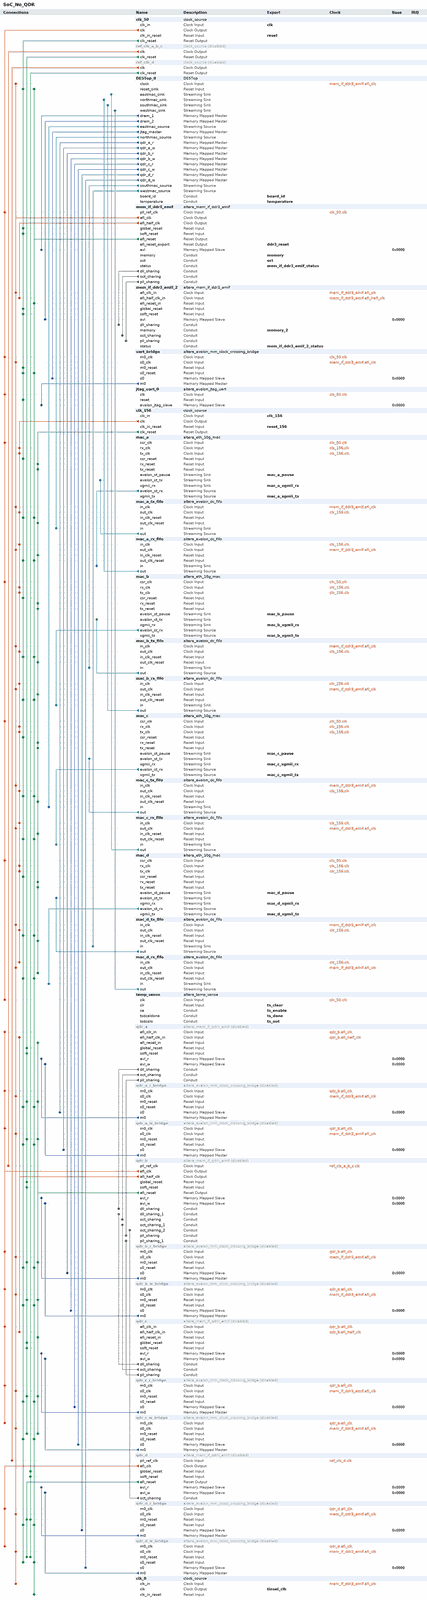
[diagram p0: system contents, whole]
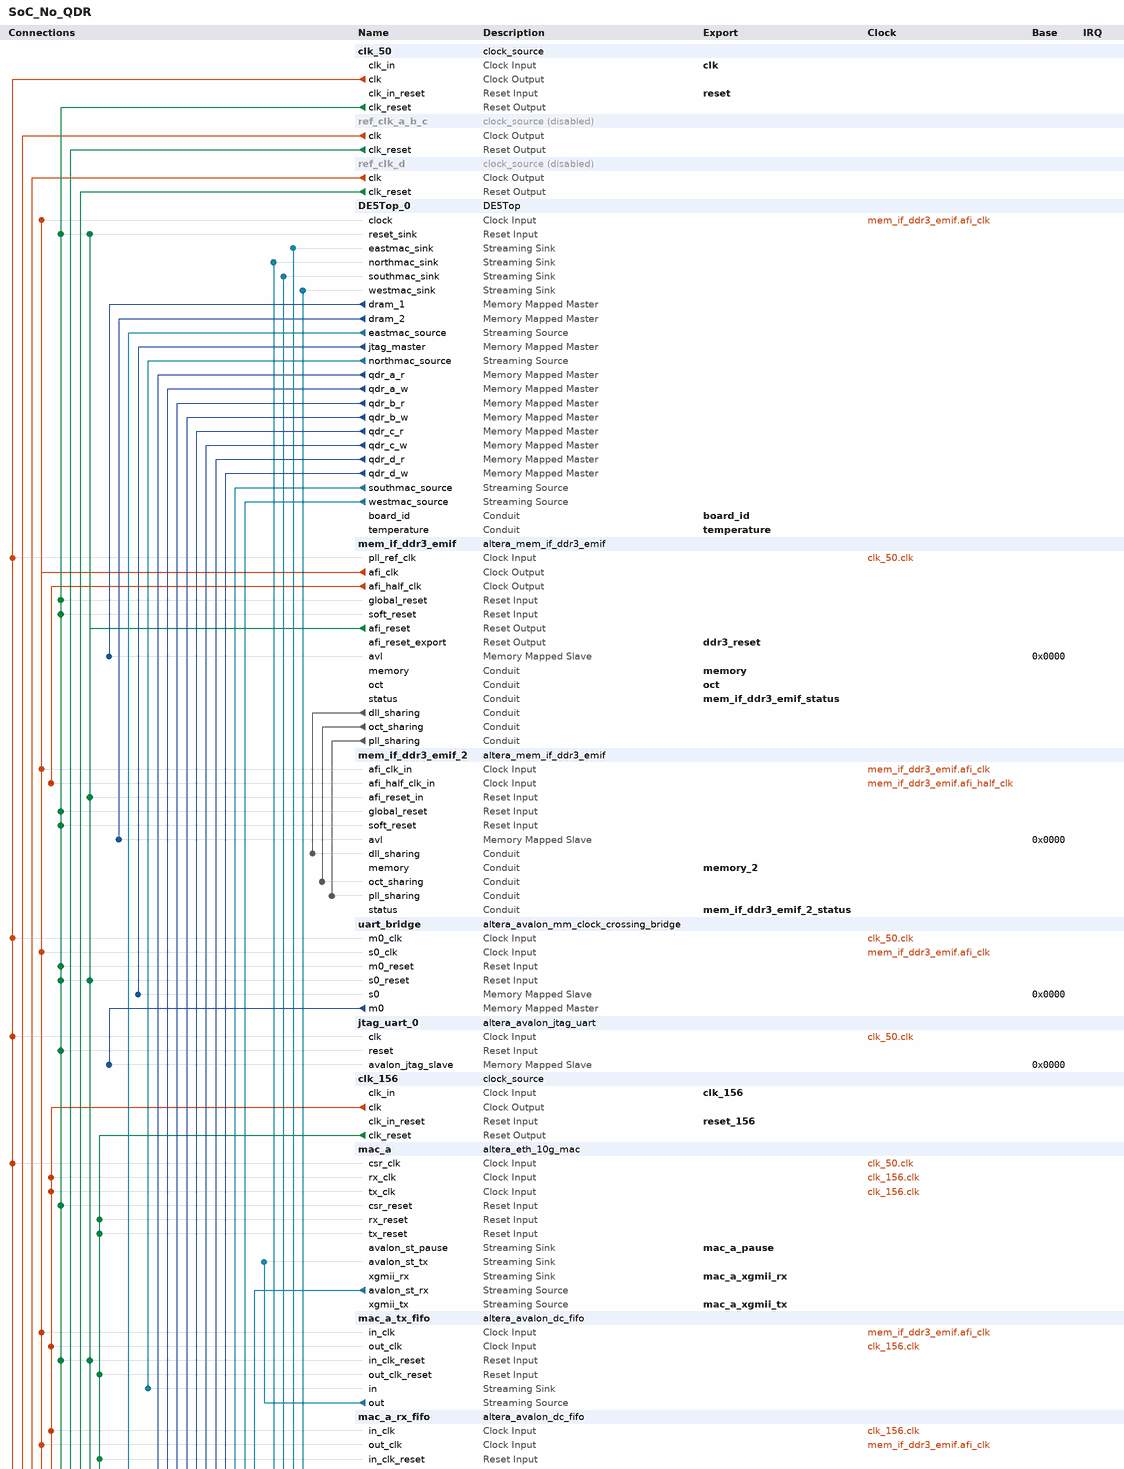
[diagram p1: system contents, upper part]
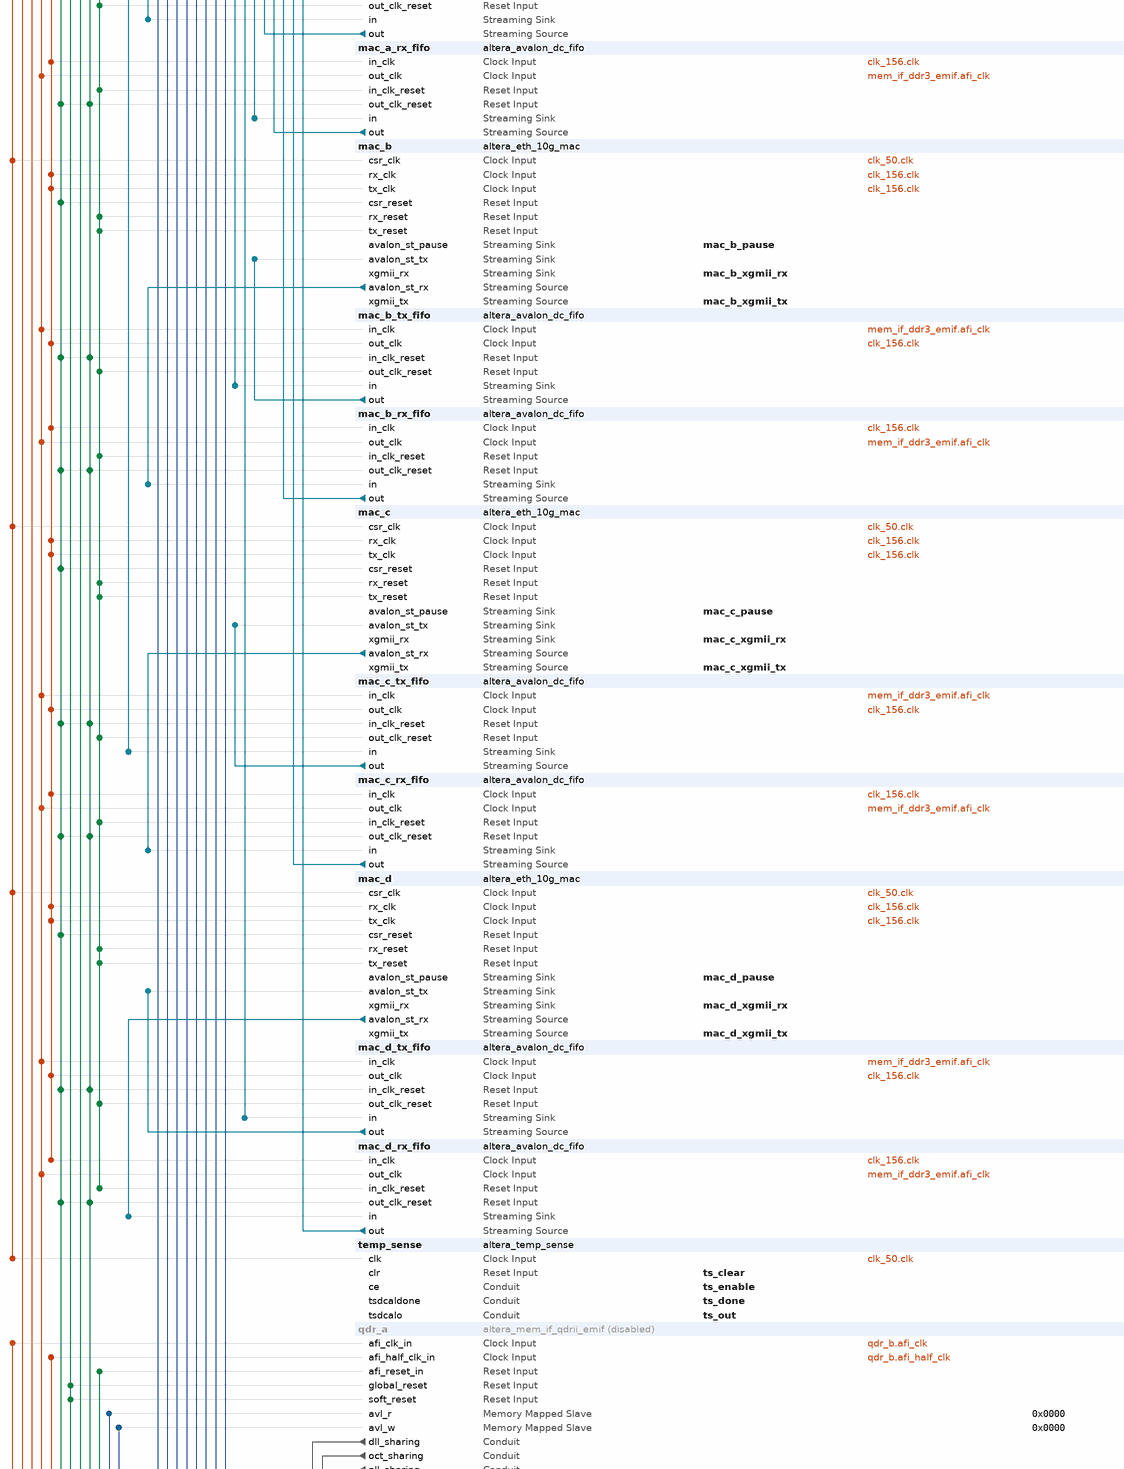
[diagram p2: system contents, middle part]
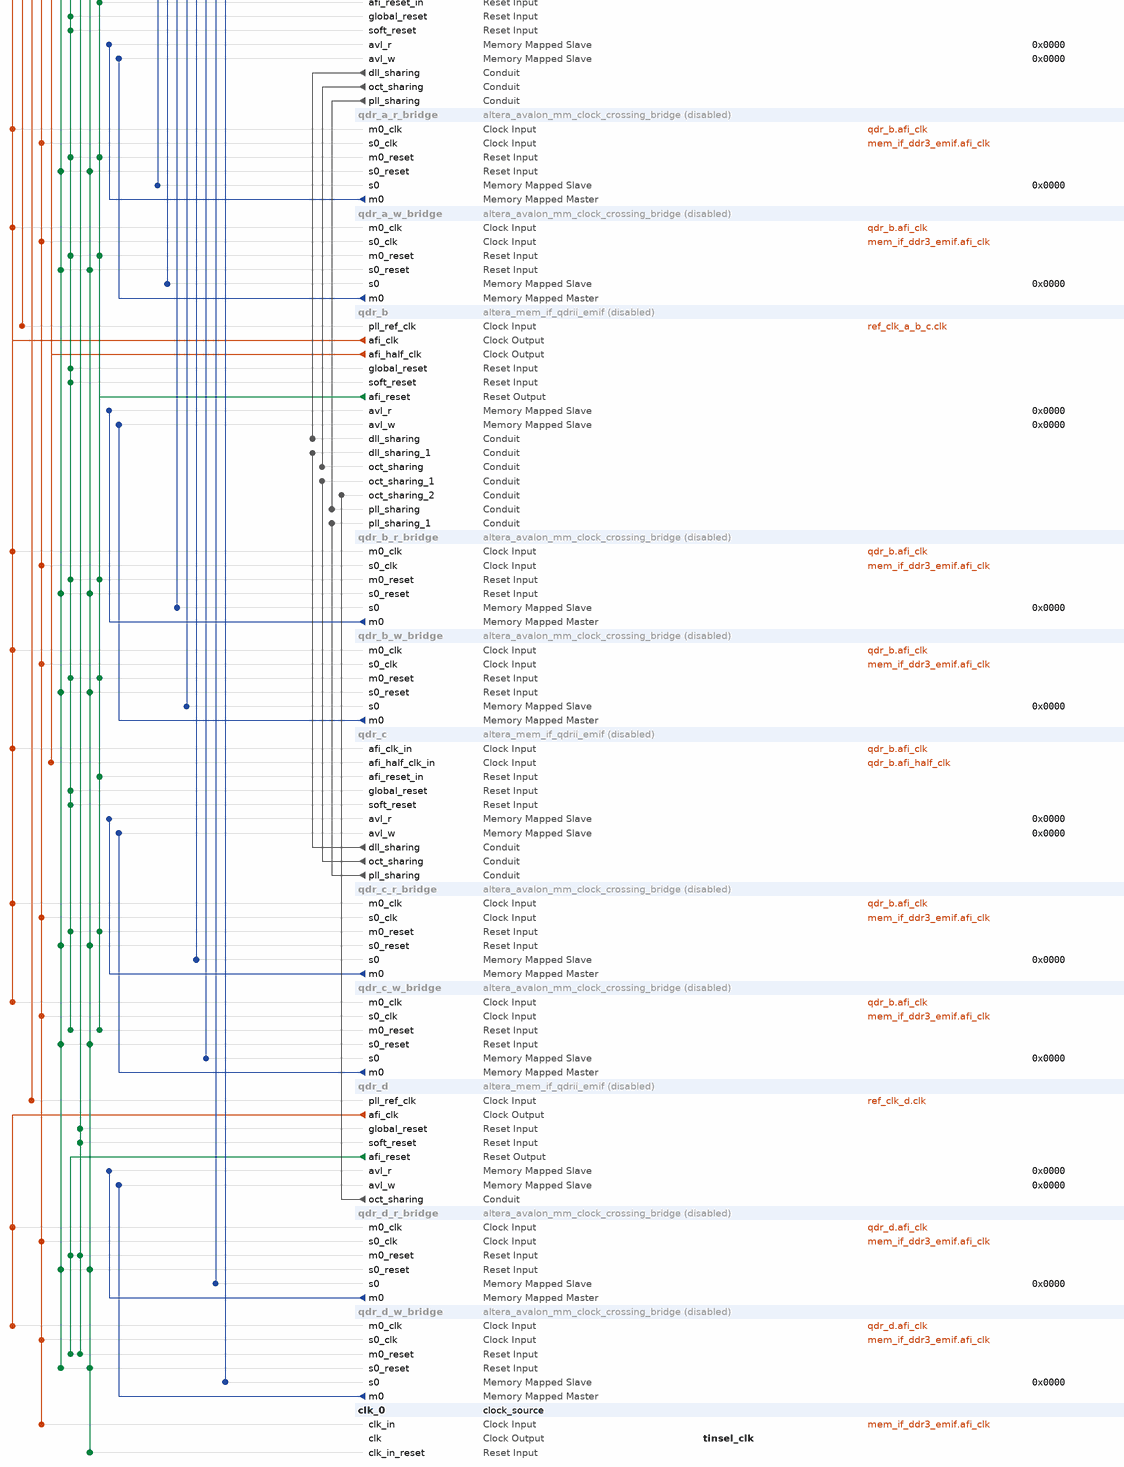
[diagram p3: system contents, lower part]
# Platform Designer (Qsys) system SoC_No_QDR, Stratix V 5SGXEA7N2F45C2
# Parameters at their usual value, and those the tool derives, are not listed.
package require -exact qsys 16.1
create_system SoC_No_QDR
set_project_property DEVICE_FAMILY {Stratix V}
set_project_property DEVICE 5SGXEA7N2F45C2

add_instance clk_50 clock_source 16.1
set_instance_parameter_value clk_50 clockFrequency 50000000

add_instance ref_clk_a_b_c clock_source 16.1
set_instance_property ref_clk_a_b_c ENABLED false
set_instance_parameter_value ref_clk_a_b_c clockFrequency 50000000

add_instance ref_clk_d clock_source 16.1
set_instance_property ref_clk_d ENABLED false
set_instance_parameter_value ref_clk_d clockFrequency 50000000

add_instance DE5Top_0 DE5Top 1.0

add_instance mem_if_ddr3_emif altera_mem_if_ddr3_emif 16.1
set_instance_parameter_value mem_if_ddr3_emif AVL_MAX_SIZE 8
set_instance_parameter_value mem_if_ddr3_emif CALIBRATION_MODE Skip
set_instance_parameter_value mem_if_ddr3_emif CPORT_TYPE_PORT Bidirectional,Bidirectional,Bidirectional,Bidirectional,Bidirectional,Bidirectional
set_instance_parameter_value mem_if_ddr3_emif CTL_LOOK_AHEAD_DEPTH 8
set_instance_parameter_value mem_if_ddr3_emif DLL_SHARING_MODE Master
set_instance_parameter_value mem_if_ddr3_emif EXPORT_AFI_HALF_CLK false
set_instance_parameter_value mem_if_ddr3_emif HARD_EMIF false
set_instance_parameter_value mem_if_ddr3_emif MEM_BANKADDR_WIDTH 3
set_instance_parameter_value mem_if_ddr3_emif MEM_CLK_FREQ 430.0
set_instance_parameter_value mem_if_ddr3_emif MEM_CLK_FREQ_MAX 800.0
set_instance_parameter_value mem_if_ddr3_emif MEM_COL_ADDR_WIDTH 10
set_instance_parameter_value mem_if_ddr3_emif MEM_DQ_WIDTH 64
set_instance_parameter_value mem_if_ddr3_emif MEM_FORMAT UNBUFFERED
set_instance_parameter_value mem_if_ddr3_emif MEM_ROW_ADDR_WIDTH 15
set_instance_parameter_value mem_if_ddr3_emif MEM_TCL 11
set_instance_parameter_value mem_if_ddr3_emif MEM_TFAW_NS 30.0
set_instance_parameter_value mem_if_ddr3_emif MEM_TRAS_NS 35.0
set_instance_parameter_value mem_if_ddr3_emif MEM_TRCD_NS 13.75
set_instance_parameter_value mem_if_ddr3_emif MEM_TRFC_NS 160.0
set_instance_parameter_value mem_if_ddr3_emif MEM_TRP_NS 13.75
set_instance_parameter_value mem_if_ddr3_emif MEM_TRRD_NS 6.0
set_instance_parameter_value mem_if_ddr3_emif MEM_TRTP_NS 7.5
set_instance_parameter_value mem_if_ddr3_emif MEM_TWTR 4
set_instance_parameter_value mem_if_ddr3_emif MEM_VENDOR Micron
set_instance_parameter_value mem_if_ddr3_emif MEM_WTCL 8
set_instance_parameter_value mem_if_ddr3_emif OCT_SHARING_MODE Master
set_instance_parameter_value mem_if_ddr3_emif PLL_LOCATION Left_Right
set_instance_parameter_value mem_if_ddr3_emif PLL_SHARING_MODE Master
set_instance_parameter_value mem_if_ddr3_emif POWER_OF_TWO_BUS true
set_instance_parameter_value mem_if_ddr3_emif PRIORITY_PORT 0,1,1,1,1,1
set_instance_parameter_value mem_if_ddr3_emif RATE Half
set_instance_parameter_value mem_if_ddr3_emif REF_CLK_FREQ 50.0
set_instance_parameter_value mem_if_ddr3_emif SPEED_GRADE 2
set_instance_parameter_value mem_if_ddr3_emif TIMING_BOARD_AC_SKEW 0.05
set_instance_parameter_value mem_if_ddr3_emif TIMING_BOARD_AC_TO_CK_SKEW 0.012
set_instance_parameter_value mem_if_ddr3_emif TIMING_BOARD_DQ_TO_DQS_SKEW 0.002
set_instance_parameter_value mem_if_ddr3_emif TIMING_BOARD_MAX_CK_DELAY 1.78
set_instance_parameter_value mem_if_ddr3_emif TIMING_BOARD_MAX_DQS_DELAY 0.7
set_instance_parameter_value mem_if_ddr3_emif TIMING_BOARD_SKEW_BETWEEN_DQS 0.1
set_instance_parameter_value mem_if_ddr3_emif TIMING_BOARD_SKEW_CKDQS_DIMM_MAX 1.29
set_instance_parameter_value mem_if_ddr3_emif TIMING_BOARD_SKEW_CKDQS_DIMM_MIN 0.06
set_instance_parameter_value mem_if_ddr3_emif TIMING_BOARD_SKEW_WITHIN_DQS 0.009
set_instance_parameter_value mem_if_ddr3_emif TIMING_TDH 45
set_instance_parameter_value mem_if_ddr3_emif TIMING_TDQSCK 255
set_instance_parameter_value mem_if_ddr3_emif TIMING_TDQSQ 100
set_instance_parameter_value mem_if_ddr3_emif TIMING_TDQSS 0.27
set_instance_parameter_value mem_if_ddr3_emif TIMING_TDS 10
set_instance_parameter_value mem_if_ddr3_emif TIMING_TDSH 0.18
set_instance_parameter_value mem_if_ddr3_emif TIMING_TDSS 0.18
set_instance_parameter_value mem_if_ddr3_emif TIMING_TIH 120
set_instance_parameter_value mem_if_ddr3_emif TIMING_TIS 170
set_instance_parameter_value mem_if_ddr3_emif TIMING_TQSH 0.4
set_instance_parameter_value mem_if_ddr3_emif USER_DEBUG_LEVEL 0

add_instance mem_if_ddr3_emif_2 altera_mem_if_ddr3_emif 16.1
set_instance_parameter_value mem_if_ddr3_emif_2 AVL_MAX_SIZE 8
set_instance_parameter_value mem_if_ddr3_emif_2 CALIBRATION_MODE Skip
set_instance_parameter_value mem_if_ddr3_emif_2 CPORT_TYPE_PORT Bidirectional,Bidirectional,Bidirectional,Bidirectional,Bidirectional,Bidirectional
set_instance_parameter_value mem_if_ddr3_emif_2 CTL_LOOK_AHEAD_DEPTH 8
set_instance_parameter_value mem_if_ddr3_emif_2 DLL_SHARING_MODE Slave
set_instance_parameter_value mem_if_ddr3_emif_2 EXPORT_AFI_HALF_CLK false
set_instance_parameter_value mem_if_ddr3_emif_2 HARD_EMIF false
set_instance_parameter_value mem_if_ddr3_emif_2 MEM_BANKADDR_WIDTH 3
set_instance_parameter_value mem_if_ddr3_emif_2 MEM_CLK_FREQ 430.0
set_instance_parameter_value mem_if_ddr3_emif_2 MEM_CLK_FREQ_MAX 800.0
set_instance_parameter_value mem_if_ddr3_emif_2 MEM_COL_ADDR_WIDTH 10
set_instance_parameter_value mem_if_ddr3_emif_2 MEM_DQ_WIDTH 64
set_instance_parameter_value mem_if_ddr3_emif_2 MEM_FORMAT UNBUFFERED
set_instance_parameter_value mem_if_ddr3_emif_2 MEM_ROW_ADDR_WIDTH 15
set_instance_parameter_value mem_if_ddr3_emif_2 MEM_TCL 11
set_instance_parameter_value mem_if_ddr3_emif_2 MEM_TFAW_NS 30.0
set_instance_parameter_value mem_if_ddr3_emif_2 MEM_TRAS_NS 35.0
set_instance_parameter_value mem_if_ddr3_emif_2 MEM_TRCD_NS 13.75
set_instance_parameter_value mem_if_ddr3_emif_2 MEM_TRFC_NS 160.0
set_instance_parameter_value mem_if_ddr3_emif_2 MEM_TRP_NS 13.75
set_instance_parameter_value mem_if_ddr3_emif_2 MEM_TRRD_NS 6.0
set_instance_parameter_value mem_if_ddr3_emif_2 MEM_TRTP_NS 7.5
set_instance_parameter_value mem_if_ddr3_emif_2 MEM_TWTR 4
set_instance_parameter_value mem_if_ddr3_emif_2 MEM_VENDOR Micron
set_instance_parameter_value mem_if_ddr3_emif_2 MEM_WTCL 8
set_instance_parameter_value mem_if_ddr3_emif_2 OCT_SHARING_MODE Slave
set_instance_parameter_value mem_if_ddr3_emif_2 PLL_LOCATION Left_Right
set_instance_parameter_value mem_if_ddr3_emif_2 PLL_SHARING_MODE Slave
set_instance_parameter_value mem_if_ddr3_emif_2 POWER_OF_TWO_BUS true
set_instance_parameter_value mem_if_ddr3_emif_2 PRIORITY_PORT 0,1,1,1,1,1
set_instance_parameter_value mem_if_ddr3_emif_2 RATE Half
set_instance_parameter_value mem_if_ddr3_emif_2 REF_CLK_FREQ 50.0
set_instance_parameter_value mem_if_ddr3_emif_2 SPEED_GRADE 2
set_instance_parameter_value mem_if_ddr3_emif_2 TIMING_BOARD_AC_SKEW 0.05
set_instance_parameter_value mem_if_ddr3_emif_2 TIMING_BOARD_AC_TO_CK_SKEW 0.012
set_instance_parameter_value mem_if_ddr3_emif_2 TIMING_BOARD_DQ_TO_DQS_SKEW 0.002
set_instance_parameter_value mem_if_ddr3_emif_2 TIMING_BOARD_MAX_CK_DELAY 1.78
set_instance_parameter_value mem_if_ddr3_emif_2 TIMING_BOARD_MAX_DQS_DELAY 0.7
set_instance_parameter_value mem_if_ddr3_emif_2 TIMING_BOARD_SKEW_BETWEEN_DQS 0.1
set_instance_parameter_value mem_if_ddr3_emif_2 TIMING_BOARD_SKEW_CKDQS_DIMM_MAX 1.29
set_instance_parameter_value mem_if_ddr3_emif_2 TIMING_BOARD_SKEW_CKDQS_DIMM_MIN 0.06
set_instance_parameter_value mem_if_ddr3_emif_2 TIMING_BOARD_SKEW_WITHIN_DQS 0.009
set_instance_parameter_value mem_if_ddr3_emif_2 TIMING_TDH 45
set_instance_parameter_value mem_if_ddr3_emif_2 TIMING_TDQSCK 255
set_instance_parameter_value mem_if_ddr3_emif_2 TIMING_TDQSQ 100
set_instance_parameter_value mem_if_ddr3_emif_2 TIMING_TDQSS 0.27
set_instance_parameter_value mem_if_ddr3_emif_2 TIMING_TDS 10
set_instance_parameter_value mem_if_ddr3_emif_2 TIMING_TDSH 0.18
set_instance_parameter_value mem_if_ddr3_emif_2 TIMING_TDSS 0.18
set_instance_parameter_value mem_if_ddr3_emif_2 TIMING_TIH 120
set_instance_parameter_value mem_if_ddr3_emif_2 TIMING_TIS 170
set_instance_parameter_value mem_if_ddr3_emif_2 TIMING_TQSH 0.4
set_instance_parameter_value mem_if_ddr3_emif_2 USER_DEBUG_LEVEL 0

add_instance uart_bridge altera_avalon_mm_clock_crossing_bridge 16.1
set_instance_parameter_value uart_bridge ADDRESS_WIDTH 10
set_instance_parameter_value uart_bridge COMMAND_FIFO_DEPTH 4
set_instance_parameter_value uart_bridge DATA_WIDTH 32
set_instance_parameter_value uart_bridge MASTER_SYNC_DEPTH 2
set_instance_parameter_value uart_bridge MAX_BURST_SIZE 1
set_instance_parameter_value uart_bridge RESPONSE_FIFO_DEPTH 4
set_instance_parameter_value uart_bridge SLAVE_SYNC_DEPTH 2
set_instance_parameter_value uart_bridge USE_AUTO_ADDRESS_WIDTH 1

add_instance jtag_uart_0 altera_avalon_jtag_uart 16.1
set_instance_parameter_value jtag_uart_0 simInteractiveOptions NO_INTERACTIVE_WINDOWS

add_instance clk_156 clock_source 16.1
set_instance_parameter_value clk_156 clockFrequency 156250000

add_instance mac_a altera_eth_10g_mac 16.1
set_instance_parameter_value mac_a DATAPATH_OPTION 3
set_instance_parameter_value mac_a ENABLE_1G10G_MAC 0
set_instance_parameter_value mac_a ENABLE_PFC 0
set_instance_parameter_value mac_a ENABLE_PTP_1STEP 0
set_instance_parameter_value mac_a ENABLE_SUPP_ADDR 0
set_instance_parameter_value mac_a ENABLE_TIMESTAMPING 0
set_instance_parameter_value mac_a ENABLE_UNIDIRECTIONAL 0
set_instance_parameter_value mac_a INSTANTIATE_STATISTICS 0
set_instance_parameter_value mac_a INSTANTIATE_TX_CRC 1
set_instance_parameter_value mac_a PFC_PRIORITY_NUM 8
set_instance_parameter_value mac_a PREAMBLE_PASSTHROUGH 0
set_instance_parameter_value mac_a REGISTER_BASED_STATISTICS 0
set_instance_parameter_value mac_a TSTAMP_FP_WIDTH 4

add_instance mac_a_tx_fifo altera_avalon_dc_fifo 16.1
set_instance_parameter_value mac_a_tx_fifo BITS_PER_SYMBOL 8
set_instance_parameter_value mac_a_tx_fifo ERROR_WIDTH 1
set_instance_parameter_value mac_a_tx_fifo FIFO_DEPTH 256
set_instance_parameter_value mac_a_tx_fifo SYMBOLS_PER_BEAT 8
set_instance_parameter_value mac_a_tx_fifo USE_PACKETS 1

add_instance mac_a_rx_fifo altera_avalon_dc_fifo 16.1
set_instance_parameter_value mac_a_rx_fifo BITS_PER_SYMBOL 8
set_instance_parameter_value mac_a_rx_fifo ERROR_WIDTH 6
set_instance_parameter_value mac_a_rx_fifo FIFO_DEPTH 256
set_instance_parameter_value mac_a_rx_fifo SYMBOLS_PER_BEAT 8
set_instance_parameter_value mac_a_rx_fifo USE_PACKETS 1

add_instance mac_b altera_eth_10g_mac 16.1
set_instance_parameter_value mac_b DATAPATH_OPTION 3
set_instance_parameter_value mac_b ENABLE_1G10G_MAC 0
set_instance_parameter_value mac_b ENABLE_PFC 0
set_instance_parameter_value mac_b ENABLE_PTP_1STEP 0
set_instance_parameter_value mac_b ENABLE_SUPP_ADDR 0
set_instance_parameter_value mac_b ENABLE_TIMESTAMPING 0
set_instance_parameter_value mac_b ENABLE_UNIDIRECTIONAL 0
set_instance_parameter_value mac_b INSTANTIATE_STATISTICS 0
set_instance_parameter_value mac_b INSTANTIATE_TX_CRC 1
set_instance_parameter_value mac_b PFC_PRIORITY_NUM 8
set_instance_parameter_value mac_b PREAMBLE_PASSTHROUGH 0
set_instance_parameter_value mac_b REGISTER_BASED_STATISTICS 0
set_instance_parameter_value mac_b TSTAMP_FP_WIDTH 4

add_instance mac_b_tx_fifo altera_avalon_dc_fifo 16.1
set_instance_parameter_value mac_b_tx_fifo BITS_PER_SYMBOL 8
set_instance_parameter_value mac_b_tx_fifo ERROR_WIDTH 1
set_instance_parameter_value mac_b_tx_fifo FIFO_DEPTH 256
set_instance_parameter_value mac_b_tx_fifo SYMBOLS_PER_BEAT 8
set_instance_parameter_value mac_b_tx_fifo USE_PACKETS 1

add_instance mac_b_rx_fifo altera_avalon_dc_fifo 16.1
set_instance_parameter_value mac_b_rx_fifo BITS_PER_SYMBOL 8
set_instance_parameter_value mac_b_rx_fifo ERROR_WIDTH 6
set_instance_parameter_value mac_b_rx_fifo FIFO_DEPTH 256
set_instance_parameter_value mac_b_rx_fifo SYMBOLS_PER_BEAT 8
set_instance_parameter_value mac_b_rx_fifo USE_PACKETS 1

add_instance mac_c altera_eth_10g_mac 16.1
set_instance_parameter_value mac_c DATAPATH_OPTION 3
set_instance_parameter_value mac_c ENABLE_1G10G_MAC 0
set_instance_parameter_value mac_c ENABLE_PFC 0
set_instance_parameter_value mac_c ENABLE_PTP_1STEP 0
set_instance_parameter_value mac_c ENABLE_SUPP_ADDR 0
set_instance_parameter_value mac_c ENABLE_TIMESTAMPING 0
set_instance_parameter_value mac_c ENABLE_UNIDIRECTIONAL 0
set_instance_parameter_value mac_c INSTANTIATE_STATISTICS 0
set_instance_parameter_value mac_c INSTANTIATE_TX_CRC 1
set_instance_parameter_value mac_c PFC_PRIORITY_NUM 8
set_instance_parameter_value mac_c PREAMBLE_PASSTHROUGH 0
set_instance_parameter_value mac_c REGISTER_BASED_STATISTICS 0
set_instance_parameter_value mac_c TSTAMP_FP_WIDTH 4

add_instance mac_c_tx_fifo altera_avalon_dc_fifo 16.1
set_instance_parameter_value mac_c_tx_fifo BITS_PER_SYMBOL 8
set_instance_parameter_value mac_c_tx_fifo ERROR_WIDTH 1
set_instance_parameter_value mac_c_tx_fifo FIFO_DEPTH 256
set_instance_parameter_value mac_c_tx_fifo SYMBOLS_PER_BEAT 8
set_instance_parameter_value mac_c_tx_fifo USE_PACKETS 1

add_instance mac_c_rx_fifo altera_avalon_dc_fifo 16.1
set_instance_parameter_value mac_c_rx_fifo BITS_PER_SYMBOL 8
set_instance_parameter_value mac_c_rx_fifo ERROR_WIDTH 6
set_instance_parameter_value mac_c_rx_fifo FIFO_DEPTH 256
set_instance_parameter_value mac_c_rx_fifo SYMBOLS_PER_BEAT 8
set_instance_parameter_value mac_c_rx_fifo USE_PACKETS 1

add_instance mac_d altera_eth_10g_mac 16.1
set_instance_parameter_value mac_d DATAPATH_OPTION 3
set_instance_parameter_value mac_d ENABLE_1G10G_MAC 0
set_instance_parameter_value mac_d ENABLE_PFC 0
set_instance_parameter_value mac_d ENABLE_PTP_1STEP 0
set_instance_parameter_value mac_d ENABLE_SUPP_ADDR 0
set_instance_parameter_value mac_d ENABLE_TIMESTAMPING 0
set_instance_parameter_value mac_d ENABLE_UNIDIRECTIONAL 0
set_instance_parameter_value mac_d INSTANTIATE_STATISTICS 0
set_instance_parameter_value mac_d INSTANTIATE_TX_CRC 1
set_instance_parameter_value mac_d PFC_PRIORITY_NUM 8
set_instance_parameter_value mac_d PREAMBLE_PASSTHROUGH 0
set_instance_parameter_value mac_d REGISTER_BASED_STATISTICS 0
set_instance_parameter_value mac_d TSTAMP_FP_WIDTH 4

add_instance mac_d_tx_fifo altera_avalon_dc_fifo 16.1
set_instance_parameter_value mac_d_tx_fifo BITS_PER_SYMBOL 8
set_instance_parameter_value mac_d_tx_fifo ERROR_WIDTH 1
set_instance_parameter_value mac_d_tx_fifo FIFO_DEPTH 256
set_instance_parameter_value mac_d_tx_fifo SYMBOLS_PER_BEAT 8
set_instance_parameter_value mac_d_tx_fifo USE_PACKETS 1

add_instance mac_d_rx_fifo altera_avalon_dc_fifo 16.1
set_instance_parameter_value mac_d_rx_fifo BITS_PER_SYMBOL 8
set_instance_parameter_value mac_d_rx_fifo ERROR_WIDTH 6
set_instance_parameter_value mac_d_rx_fifo FIFO_DEPTH 256
set_instance_parameter_value mac_d_rx_fifo SYMBOLS_PER_BEAT 8
set_instance_parameter_value mac_d_rx_fifo USE_PACKETS 1

add_instance temp_sense altera_temp_sense 16.1
set_instance_parameter_value temp_sense CBX_AUTO_BLACKBOX ALL
set_instance_parameter_value temp_sense CE_CHECK true
set_instance_parameter_value temp_sense CLK_FREQUENCY 50.0
set_instance_parameter_value temp_sense CLOCK_DIVIDER_VALUE 80
set_instance_parameter_value temp_sense CLR_CHECK true
set_instance_parameter_value temp_sense NUMBER_OF_SAMPLES 128
set_instance_parameter_value temp_sense POI_CAL_TEMPERATURE 85
set_instance_parameter_value temp_sense SIM_TSDCALO 0
set_instance_parameter_value temp_sense USER_OFFSET_ENABLE off
set_instance_parameter_value temp_sense USE_WYS on

add_instance qdr_a altera_mem_if_qdrii_emif 16.1
set_instance_property qdr_a ENABLED false
set_instance_parameter_value qdr_a ABSTRACT_REAL_COMPARE_TEST false
set_instance_parameter_value qdr_a ACV_PHY_CLK_ADD_FR_PHASE 0.0
set_instance_parameter_value qdr_a AC_PACKAGE_DESKEW true
set_instance_parameter_value qdr_a AC_ROM_USER_ADD_0 0_0000_0000_0000
set_instance_parameter_value qdr_a AC_ROM_USER_ADD_1 0_0000_0000_1000
set_instance_parameter_value qdr_a ADD_EFFICIENCY_MONITOR false
set_instance_parameter_value qdr_a ADD_EXTERNAL_SEQ_DEBUG_NIOS false
set_instance_parameter_value qdr_a ADVERTIZE_SEQUENCER_SW_BUILD_FILES false
set_instance_parameter_value qdr_a AFI_DEBUG_INFO_WIDTH 32
set_instance_parameter_value qdr_a AVL_MAX_SIZE 4
set_instance_parameter_value qdr_a BYTE_ENABLE false
set_instance_parameter_value qdr_a C2P_WRITE_CLOCK_ADD_PHASE 0.0
set_instance_parameter_value qdr_a CALIBRATION_MODE Full
set_instance_parameter_value qdr_a CALIB_REG_WIDTH 8
set_instance_parameter_value qdr_a COMMAND_PHASE 0
set_instance_parameter_value qdr_a CORE_DEBUG_CONNECTION EXPORT
set_instance_parameter_value qdr_a CTL_LATENCY 1
set_instance_parameter_value qdr_a CUT_NEW_FAMILY_TIMING true
set_instance_parameter_value qdr_a DEVICE_DEPTH 1
set_instance_parameter_value qdr_a DEVICE_WIDTH 1
set_instance_parameter_value qdr_a DISABLE_CHILD_MESSAGING false
set_instance_parameter_value qdr_a DLL_SHARING_MODE Slave
set_instance_parameter_value qdr_a DQS_DQSN_MODE COMPLEMENTARY
set_instance_parameter_value qdr_a DQ_INPUT_REG_USE_CLKN true
set_instance_parameter_value qdr_a DUPLICATE_AC false
set_instance_parameter_value qdr_a ED_EXPORT_SEQ_DEBUG false
set_instance_parameter_value qdr_a EMULATED_MODE false
set_instance_parameter_value qdr_a EMULATED_WRITE_GROUPS 2
set_instance_parameter_value qdr_a ENABLE_CTRL_AVALON_INTERFACE true
set_instance_parameter_value qdr_a ENABLE_DELAY_CHAIN_WRITE false
set_instance_parameter_value qdr_a ENABLE_EMIT_BFM_MASTER false
set_instance_parameter_value qdr_a ENABLE_EXPORT_SEQ_DEBUG_BRIDGE false
set_instance_parameter_value qdr_a ENABLE_EXTRA_REPORTING false
set_instance_parameter_value qdr_a ENABLE_ISS_PROBES false
set_instance_parameter_value qdr_a ENABLE_NON_DESTRUCTIVE_CALIB false
set_instance_parameter_value qdr_a ENABLE_NON_DES_CAL false
set_instance_parameter_value qdr_a ENABLE_NON_DES_CAL_TEST false
set_instance_parameter_value qdr_a ENABLE_SEQUENCER_MARGINING_ON_BY_DEFAULT false
set_instance_parameter_value qdr_a EXPORT_AFI_HALF_CLK false
set_instance_parameter_value qdr_a FIX_READ_LATENCY 8
set_instance_parameter_value qdr_a FORCE_DQS_TRACKING AUTO
set_instance_parameter_value qdr_a FORCE_MAX_LATENCY_COUNT_WIDTH 0
set_instance_parameter_value qdr_a FORCE_SEQUENCER_TCL_DEBUG_MODE false
set_instance_parameter_value qdr_a FORCE_SHADOW_REGS AUTO
set_instance_parameter_value qdr_a HARD_EMIF false
set_instance_parameter_value qdr_a HCX_COMPAT_MODE false
set_instance_parameter_value qdr_a HHP_HPS false
set_instance_parameter_value qdr_a HHP_HPS_SIMULATION false
set_instance_parameter_value qdr_a HHP_HPS_VERIFICATION false
set_instance_parameter_value qdr_a HPS_PROTOCOL DEFAULT
set_instance_parameter_value qdr_a INCLUDE_BOARD_DELAY_MODEL false
set_instance_parameter_value qdr_a INCLUDE_MULTIRANK_BOARD_DELAY_MODEL false
set_instance_parameter_value qdr_a IO_STANDARD {1.8-V HSTL}
set_instance_parameter_value qdr_a IS_ES_DEVICE false
set_instance_parameter_value qdr_a MARGIN_VARIATION_TEST false
set_instance_parameter_value qdr_a MAX10_RTL_SEQ false
set_instance_parameter_value qdr_a MEM_ADDR_WIDTH 20
set_instance_parameter_value qdr_a MEM_BURST_LENGTH 4
set_instance_parameter_value qdr_a MEM_CK_PHASE 0.0
set_instance_parameter_value qdr_a MEM_CLK_FREQ 450.0
set_instance_parameter_value qdr_a MEM_CONTROL_WIDTH 1
set_instance_parameter_value qdr_a MEM_CS_WIDTH 1
set_instance_parameter_value qdr_a MEM_DENALI_SOMA_FILE qdrii.soma
set_instance_parameter_value qdr_a MEM_DEVICE MISSING_MODEL
set_instance_parameter_value qdr_a MEM_DM_WIDTH 2
set_instance_parameter_value qdr_a MEM_DQ_WIDTH 18
set_instance_parameter_value qdr_a MEM_IF_BOARD_BASE_DELAY 10
set_instance_parameter_value qdr_a MEM_IF_DM_PINS_EN true
set_instance_parameter_value qdr_a MEM_IF_DQSN_EN true
set_instance_parameter_value qdr_a MEM_LEVELING false
set_instance_parameter_value qdr_a MEM_READ_DQS_WIDTH 1
set_instance_parameter_value qdr_a MEM_SUPPRESS_CMD_TIMING_ERROR 0
set_instance_parameter_value qdr_a MEM_T_RL 2.5
set_instance_parameter_value qdr_a MEM_T_WL 1
set_instance_parameter_value qdr_a MEM_USE_DENALI_MODEL false
set_instance_parameter_value qdr_a MEM_VERBOSE true
set_instance_parameter_value qdr_a MEM_WRITE_DQS_WIDTH 1
set_instance_parameter_value qdr_a MRS_MIRROR_PING_PONG_ATSO false
set_instance_parameter_value qdr_a NIOS_ROM_DATA_WIDTH 32
set_instance_parameter_value qdr_a NUM_DLL_SHARING_INTERFACES 1
set_instance_parameter_value qdr_a NUM_EXTRA_REPORT_PATH 10
set_instance_parameter_value qdr_a NUM_OCT_SHARING_INTERFACES 1
set_instance_parameter_value qdr_a NUM_PLL_SHARING_INTERFACES 1
set_instance_parameter_value qdr_a OCT_SHARING_MODE Slave
set_instance_parameter_value qdr_a P2C_READ_CLOCK_ADD_PHASE 0.0
set_instance_parameter_value qdr_a PACKAGE_DESKEW true
set_instance_parameter_value qdr_a PARSE_FRIENDLY_DEVICE_FAMILY_PARAM_VALID false
set_instance_parameter_value qdr_a PHY_CSR_ENABLED false
set_instance_parameter_value qdr_a PHY_ONLY false
set_instance_parameter_value qdr_a PINGPONGPHY_EN false
set_instance_parameter_value qdr_a PLL_ADDR_CMD_CLK_DIV_PARAM 0
set_instance_parameter_value qdr_a PLL_ADDR_CMD_CLK_FREQ_PARAM 0.0
set_instance_parameter_value qdr_a PLL_ADDR_CMD_CLK_MULT_PARAM 0
set_instance_parameter_value qdr_a PLL_ADDR_CMD_CLK_PHASE_PS_PARAM 0
set_instance_parameter_value qdr_a PLL_AFI_CLK_DIV_PARAM 0
set_instance_parameter_value qdr_a PLL_AFI_CLK_FREQ_PARAM 0.0
set_instance_parameter_value qdr_a PLL_AFI_CLK_MULT_PARAM 0
set_instance_parameter_value qdr_a PLL_AFI_CLK_PHASE_PS_PARAM 0
set_instance_parameter_value qdr_a PLL_AFI_HALF_CLK_DIV_PARAM 0
set_instance_parameter_value qdr_a PLL_AFI_HALF_CLK_FREQ_PARAM 0.0
set_instance_parameter_value qdr_a PLL_AFI_HALF_CLK_MULT_PARAM 0
set_instance_parameter_value qdr_a PLL_AFI_HALF_CLK_PHASE_PS_PARAM 0
set_instance_parameter_value qdr_a PLL_AFI_PHY_CLK_DIV_PARAM 0
set_instance_parameter_value qdr_a PLL_AFI_PHY_CLK_FREQ_PARAM 0.0
set_instance_parameter_value qdr_a PLL_AFI_PHY_CLK_MULT_PARAM 0
set_instance_parameter_value qdr_a PLL_AFI_PHY_CLK_PHASE_PS_PARAM 0
set_instance_parameter_value qdr_a PLL_C2P_WRITE_CLK_DIV_PARAM 0
set_instance_parameter_value qdr_a PLL_C2P_WRITE_CLK_FREQ_PARAM 0.0
set_instance_parameter_value qdr_a PLL_C2P_WRITE_CLK_MULT_PARAM 0
set_instance_parameter_value qdr_a PLL_C2P_WRITE_CLK_PHASE_PS_PARAM 0
set_instance_parameter_value qdr_a PLL_CLK_PARAM_VALID false
set_instance_parameter_value qdr_a PLL_CONFIG_CLK_DIV_PARAM 0
set_instance_parameter_value qdr_a PLL_CONFIG_CLK_FREQ_PARAM 0.0
set_instance_parameter_value qdr_a PLL_CONFIG_CLK_MULT_PARAM 0
set_instance_parameter_value qdr_a PLL_CONFIG_CLK_PHASE_PS_PARAM 0
set_instance_parameter_value qdr_a PLL_DR_CLK_DIV_PARAM 0
set_instance_parameter_value qdr_a PLL_DR_CLK_FREQ_PARAM 0.0
set_instance_parameter_value qdr_a PLL_DR_CLK_MULT_PARAM 0
set_instance_parameter_value qdr_a PLL_DR_CLK_PHASE_PS_PARAM 0
set_instance_parameter_value qdr_a PLL_HR_CLK_DIV_PARAM 0
set_instance_parameter_value qdr_a PLL_HR_CLK_FREQ_PARAM 0.0
set_instance_parameter_value qdr_a PLL_HR_CLK_MULT_PARAM 0
set_instance_parameter_value qdr_a PLL_HR_CLK_PHASE_PS_PARAM 0
set_instance_parameter_value qdr_a PLL_LOCATION Top_Bottom
set_instance_parameter_value qdr_a PLL_MEM_CLK_DIV_PARAM 0
set_instance_parameter_value qdr_a PLL_MEM_CLK_FREQ_PARAM 0.0
set_instance_parameter_value qdr_a PLL_MEM_CLK_MULT_PARAM 0
set_instance_parameter_value qdr_a PLL_MEM_CLK_PHASE_PS_PARAM 0
set_instance_parameter_value qdr_a PLL_NIOS_CLK_DIV_PARAM 0
set_instance_parameter_value qdr_a PLL_NIOS_CLK_FREQ_PARAM 0.0
set_instance_parameter_value qdr_a PLL_NIOS_CLK_MULT_PARAM 0
set_instance_parameter_value qdr_a PLL_NIOS_CLK_PHASE_PS_PARAM 0
set_instance_parameter_value qdr_a PLL_P2C_READ_CLK_DIV_PARAM 0
set_instance_parameter_value qdr_a PLL_P2C_READ_CLK_FREQ_PARAM 0.0
set_instance_parameter_value qdr_a PLL_P2C_READ_CLK_MULT_PARAM 0
set_instance_parameter_value qdr_a PLL_P2C_READ_CLK_PHASE_PS_PARAM 0
set_instance_parameter_value qdr_a PLL_SHARING_MODE Slave
set_instance_parameter_value qdr_a PLL_WRITE_CLK_DIV_PARAM 0
set_instance_parameter_value qdr_a PLL_WRITE_CLK_FREQ_PARAM 0.0
set_instance_parameter_value qdr_a PLL_WRITE_CLK_MULT_PARAM 0
set_instance_parameter_value qdr_a PLL_WRITE_CLK_PHASE_PS_PARAM 0
set_instance_parameter_value qdr_a POWER_OF_TWO_BUS true
set_instance_parameter_value qdr_a QDRII_PLUS_MODE false
set_instance_parameter_value qdr_a RATE Half
set_instance_parameter_value qdr_a READ_DQ_DQS_CLOCK_SOURCE DQS_BUS
set_instance_parameter_value qdr_a READ_FIFO_SIZE 8
set_instance_parameter_value qdr_a REFRESH_INTERVAL 15000
set_instance_parameter_value qdr_a REF_CLK_FREQ 50.0
set_instance_parameter_value qdr_a REF_CLK_FREQ_MAX_PARAM 0.0
set_instance_parameter_value qdr_a REF_CLK_FREQ_MIN_PARAM 0.0
set_instance_parameter_value qdr_a REF_CLK_FREQ_PARAM_VALID false
set_instance_parameter_value qdr_a SEQUENCER_TYPE NIOS
set_instance_parameter_value qdr_a SKIP_MEM_INIT true
set_instance_parameter_value qdr_a SOPC_COMPAT_RESET false
set_instance_parameter_value qdr_a SPEED_GRADE 2
set_instance_parameter_value qdr_a TIMING_ADDR_CTRL_SKEW 36
set_instance_parameter_value qdr_a TIMING_BOARD_AC_EYE_REDUCTION_H 0
set_instance_parameter_value qdr_a TIMING_BOARD_AC_EYE_REDUCTION_SU 0
set_instance_parameter_value qdr_a TIMING_BOARD_AC_TO_CK_SKEW 8
set_instance_parameter_value qdr_a TIMING_BOARD_DATA_TO_CQ_SKEW 8
set_instance_parameter_value qdr_a TIMING_BOARD_DATA_TO_K_SKEW 10
set_instance_parameter_value qdr_a TIMING_BOARD_DELTA_DQS_ARRIVAL_TIME 0
set_instance_parameter_value qdr_a TIMING_BOARD_DELTA_READ_DQS_ARRIVAL_TIME 0.0
set_instance_parameter_value qdr_a TIMING_BOARD_DQ_EYE_REDUCTION 0
set_instance_parameter_value qdr_a TIMING_BOARD_READ_DQ_EYE_REDUCTION 0.0
set_instance_parameter_value qdr_a TIMING_BOARD_SKEW 20
set_instance_parameter_value qdr_a TIMING_BOARD_SKEW_BETWEEN_DIMMS 0
set_instance_parameter_value qdr_a TIMING_BOARD_SKEW_BETWEEN_DQS 16
set_instance_parameter_value qdr_a TIMING_BOARD_SKEW_WITHIN_CQ 16
set_instance_parameter_value qdr_a TIMING_BOARD_SKEW_WITHIN_K 23
set_instance_parameter_value qdr_a TIMING_QDR_INTERNAL_JITTER 150
set_instance_parameter_value qdr_a TIMING_TCQD 200
set_instance_parameter_value qdr_a TIMING_TCQDOH -200
set_instance_parameter_value qdr_a TIMING_TCQHCQnH 895
set_instance_parameter_value qdr_a TIMING_THA 300
set_instance_parameter_value qdr_a TIMING_THD 250
set_instance_parameter_value qdr_a TIMING_TKH 400
set_instance_parameter_value qdr_a TIMING_TKHKnH 990
set_instance_parameter_value qdr_a TIMING_TSA 300
set_instance_parameter_value qdr_a TIMING_TSD 250
set_instance_parameter_value qdr_a TRACKING_ERROR_TEST false
set_instance_parameter_value qdr_a TRACKING_WATCH_TEST false
set_instance_parameter_value qdr_a TREFI 35100
set_instance_parameter_value qdr_a TRFC 350
set_instance_parameter_value qdr_a USER_DEBUG_LEVEL 0
set_instance_parameter_value qdr_a USE_FAKE_PHY false
set_instance_parameter_value qdr_a USE_MEM_CLK_FREQ false
set_instance_parameter_value qdr_a USE_SEQUENCER_BFM false

add_instance qdr_a_r_bridge altera_avalon_mm_clock_crossing_bridge 16.1
set_instance_property qdr_a_r_bridge ENABLED false
set_instance_parameter_value qdr_a_r_bridge ADDRESS_UNITS WORDS
set_instance_parameter_value qdr_a_r_bridge ADDRESS_WIDTH 20
set_instance_parameter_value qdr_a_r_bridge COMMAND_FIFO_DEPTH 16
set_instance_parameter_value qdr_a_r_bridge DATA_WIDTH 64
set_instance_parameter_value qdr_a_r_bridge MASTER_SYNC_DEPTH 2
set_instance_parameter_value qdr_a_r_bridge MAX_BURST_SIZE 4
set_instance_parameter_value qdr_a_r_bridge RESPONSE_FIFO_DEPTH 32
set_instance_parameter_value qdr_a_r_bridge SLAVE_SYNC_DEPTH 2
set_instance_parameter_value qdr_a_r_bridge USE_AUTO_ADDRESS_WIDTH 0

add_instance qdr_a_w_bridge altera_avalon_mm_clock_crossing_bridge 16.1
set_instance_property qdr_a_w_bridge ENABLED false
set_instance_parameter_value qdr_a_w_bridge ADDRESS_UNITS WORDS
set_instance_parameter_value qdr_a_w_bridge ADDRESS_WIDTH 20
set_instance_parameter_value qdr_a_w_bridge COMMAND_FIFO_DEPTH 16
set_instance_parameter_value qdr_a_w_bridge DATA_WIDTH 64
set_instance_parameter_value qdr_a_w_bridge MASTER_SYNC_DEPTH 2
set_instance_parameter_value qdr_a_w_bridge MAX_BURST_SIZE 4
set_instance_parameter_value qdr_a_w_bridge RESPONSE_FIFO_DEPTH 32
set_instance_parameter_value qdr_a_w_bridge SLAVE_SYNC_DEPTH 2
set_instance_parameter_value qdr_a_w_bridge USE_AUTO_ADDRESS_WIDTH 0

add_instance qdr_b altera_mem_if_qdrii_emif 16.1
set_instance_property qdr_b ENABLED false
set_instance_parameter_value qdr_b ABSTRACT_REAL_COMPARE_TEST false
set_instance_parameter_value qdr_b ACV_PHY_CLK_ADD_FR_PHASE 0.0
set_instance_parameter_value qdr_b AC_PACKAGE_DESKEW true
set_instance_parameter_value qdr_b AC_ROM_USER_ADD_0 0_0000_0000_0000
set_instance_parameter_value qdr_b AC_ROM_USER_ADD_1 0_0000_0000_1000
set_instance_parameter_value qdr_b ADD_EFFICIENCY_MONITOR false
set_instance_parameter_value qdr_b ADD_EXTERNAL_SEQ_DEBUG_NIOS false
set_instance_parameter_value qdr_b ADVERTIZE_SEQUENCER_SW_BUILD_FILES false
set_instance_parameter_value qdr_b AFI_DEBUG_INFO_WIDTH 32
set_instance_parameter_value qdr_b AVL_MAX_SIZE 4
set_instance_parameter_value qdr_b BYTE_ENABLE false
set_instance_parameter_value qdr_b C2P_WRITE_CLOCK_ADD_PHASE 0.0
set_instance_parameter_value qdr_b CALIBRATION_MODE Full
set_instance_parameter_value qdr_b CALIB_REG_WIDTH 8
set_instance_parameter_value qdr_b COMMAND_PHASE 0
set_instance_parameter_value qdr_b CORE_DEBUG_CONNECTION EXPORT
set_instance_parameter_value qdr_b CTL_LATENCY 1
set_instance_parameter_value qdr_b CUT_NEW_FAMILY_TIMING true
set_instance_parameter_value qdr_b DEVICE_DEPTH 1
set_instance_parameter_value qdr_b DEVICE_WIDTH 1
set_instance_parameter_value qdr_b DISABLE_CHILD_MESSAGING false
set_instance_parameter_value qdr_b DLL_SHARING_MODE Master
set_instance_parameter_value qdr_b DQS_DQSN_MODE COMPLEMENTARY
set_instance_parameter_value qdr_b DQ_INPUT_REG_USE_CLKN true
set_instance_parameter_value qdr_b DUPLICATE_AC false
set_instance_parameter_value qdr_b ED_EXPORT_SEQ_DEBUG false
set_instance_parameter_value qdr_b EMULATED_MODE false
set_instance_parameter_value qdr_b EMULATED_WRITE_GROUPS 2
set_instance_parameter_value qdr_b ENABLE_CTRL_AVALON_INTERFACE true
set_instance_parameter_value qdr_b ENABLE_DELAY_CHAIN_WRITE false
set_instance_parameter_value qdr_b ENABLE_EMIT_BFM_MASTER false
set_instance_parameter_value qdr_b ENABLE_EXPORT_SEQ_DEBUG_BRIDGE false
set_instance_parameter_value qdr_b ENABLE_EXTRA_REPORTING false
set_instance_parameter_value qdr_b ENABLE_ISS_PROBES false
set_instance_parameter_value qdr_b ENABLE_NON_DESTRUCTIVE_CALIB false
set_instance_parameter_value qdr_b ENABLE_NON_DES_CAL false
set_instance_parameter_value qdr_b ENABLE_NON_DES_CAL_TEST false
set_instance_parameter_value qdr_b ENABLE_SEQUENCER_MARGINING_ON_BY_DEFAULT false
set_instance_parameter_value qdr_b EXPORT_AFI_HALF_CLK false
set_instance_parameter_value qdr_b FIX_READ_LATENCY 8
set_instance_parameter_value qdr_b FORCE_DQS_TRACKING AUTO
set_instance_parameter_value qdr_b FORCE_MAX_LATENCY_COUNT_WIDTH 0
set_instance_parameter_value qdr_b FORCE_SEQUENCER_TCL_DEBUG_MODE false
set_instance_parameter_value qdr_b FORCE_SHADOW_REGS AUTO
set_instance_parameter_value qdr_b HARD_EMIF false
set_instance_parameter_value qdr_b HCX_COMPAT_MODE false
set_instance_parameter_value qdr_b HHP_HPS false
set_instance_parameter_value qdr_b HHP_HPS_SIMULATION false
set_instance_parameter_value qdr_b HHP_HPS_VERIFICATION false
set_instance_parameter_value qdr_b HPS_PROTOCOL DEFAULT
set_instance_parameter_value qdr_b INCLUDE_BOARD_DELAY_MODEL false
set_instance_parameter_value qdr_b INCLUDE_MULTIRANK_BOARD_DELAY_MODEL false
set_instance_parameter_value qdr_b IO_STANDARD {1.8-V HSTL}
set_instance_parameter_value qdr_b IS_ES_DEVICE false
set_instance_parameter_value qdr_b MARGIN_VARIATION_TEST false
set_instance_parameter_value qdr_b MAX10_RTL_SEQ false
set_instance_parameter_value qdr_b MEM_ADDR_WIDTH 20
set_instance_parameter_value qdr_b MEM_BURST_LENGTH 4
set_instance_parameter_value qdr_b MEM_CK_PHASE 0.0
set_instance_parameter_value qdr_b MEM_CLK_FREQ 450.0
set_instance_parameter_value qdr_b MEM_CONTROL_WIDTH 1
set_instance_parameter_value qdr_b MEM_CS_WIDTH 1
set_instance_parameter_value qdr_b MEM_DENALI_SOMA_FILE qdrii.soma
set_instance_parameter_value qdr_b MEM_DEVICE MISSING_MODEL
set_instance_parameter_value qdr_b MEM_DM_WIDTH 2
set_instance_parameter_value qdr_b MEM_DQ_WIDTH 18
set_instance_parameter_value qdr_b MEM_IF_BOARD_BASE_DELAY 10
set_instance_parameter_value qdr_b MEM_IF_DM_PINS_EN true
set_instance_parameter_value qdr_b MEM_IF_DQSN_EN true
set_instance_parameter_value qdr_b MEM_LEVELING false
set_instance_parameter_value qdr_b MEM_READ_DQS_WIDTH 1
set_instance_parameter_value qdr_b MEM_SUPPRESS_CMD_TIMING_ERROR 0
set_instance_parameter_value qdr_b MEM_T_RL 2.5
set_instance_parameter_value qdr_b MEM_T_WL 1
set_instance_parameter_value qdr_b MEM_USE_DENALI_MODEL false
set_instance_parameter_value qdr_b MEM_VERBOSE true
set_instance_parameter_value qdr_b MEM_WRITE_DQS_WIDTH 1
set_instance_parameter_value qdr_b MRS_MIRROR_PING_PONG_ATSO false
set_instance_parameter_value qdr_b NIOS_ROM_DATA_WIDTH 32
set_instance_parameter_value qdr_b NUM_DLL_SHARING_INTERFACES 2
set_instance_parameter_value qdr_b NUM_EXTRA_REPORT_PATH 10
set_instance_parameter_value qdr_b NUM_OCT_SHARING_INTERFACES 3
set_instance_parameter_value qdr_b NUM_PLL_SHARING_INTERFACES 2
set_instance_parameter_value qdr_b OCT_SHARING_MODE Master
set_instance_parameter_value qdr_b P2C_READ_CLOCK_ADD_PHASE 0.0
set_instance_parameter_value qdr_b PACKAGE_DESKEW true
set_instance_parameter_value qdr_b PARSE_FRIENDLY_DEVICE_FAMILY_PARAM_VALID false
set_instance_parameter_value qdr_b PHY_CSR_ENABLED false
set_instance_parameter_value qdr_b PHY_ONLY false
set_instance_parameter_value qdr_b PINGPONGPHY_EN false
set_instance_parameter_value qdr_b PLL_ADDR_CMD_CLK_DIV_PARAM 0
set_instance_parameter_value qdr_b PLL_ADDR_CMD_CLK_FREQ_PARAM 0.0
set_instance_parameter_value qdr_b PLL_ADDR_CMD_CLK_MULT_PARAM 0
set_instance_parameter_value qdr_b PLL_ADDR_CMD_CLK_PHASE_PS_PARAM 0
set_instance_parameter_value qdr_b PLL_AFI_CLK_DIV_PARAM 0
set_instance_parameter_value qdr_b PLL_AFI_CLK_FREQ_PARAM 0.0
set_instance_parameter_value qdr_b PLL_AFI_CLK_MULT_PARAM 0
set_instance_parameter_value qdr_b PLL_AFI_CLK_PHASE_PS_PARAM 0
set_instance_parameter_value qdr_b PLL_AFI_HALF_CLK_DIV_PARAM 0
set_instance_parameter_value qdr_b PLL_AFI_HALF_CLK_FREQ_PARAM 0.0
set_instance_parameter_value qdr_b PLL_AFI_HALF_CLK_MULT_PARAM 0
set_instance_parameter_value qdr_b PLL_AFI_HALF_CLK_PHASE_PS_PARAM 0
set_instance_parameter_value qdr_b PLL_AFI_PHY_CLK_DIV_PARAM 0
set_instance_parameter_value qdr_b PLL_AFI_PHY_CLK_FREQ_PARAM 0.0
set_instance_parameter_value qdr_b PLL_AFI_PHY_CLK_MULT_PARAM 0
set_instance_parameter_value qdr_b PLL_AFI_PHY_CLK_PHASE_PS_PARAM 0
set_instance_parameter_value qdr_b PLL_C2P_WRITE_CLK_DIV_PARAM 0
set_instance_parameter_value qdr_b PLL_C2P_WRITE_CLK_FREQ_PARAM 0.0
set_instance_parameter_value qdr_b PLL_C2P_WRITE_CLK_MULT_PARAM 0
set_instance_parameter_value qdr_b PLL_C2P_WRITE_CLK_PHASE_PS_PARAM 0
set_instance_parameter_value qdr_b PLL_CLK_PARAM_VALID false
set_instance_parameter_value qdr_b PLL_CONFIG_CLK_DIV_PARAM 0
set_instance_parameter_value qdr_b PLL_CONFIG_CLK_FREQ_PARAM 0.0
set_instance_parameter_value qdr_b PLL_CONFIG_CLK_MULT_PARAM 0
set_instance_parameter_value qdr_b PLL_CONFIG_CLK_PHASE_PS_PARAM 0
set_instance_parameter_value qdr_b PLL_DR_CLK_DIV_PARAM 0
set_instance_parameter_value qdr_b PLL_DR_CLK_FREQ_PARAM 0.0
set_instance_parameter_value qdr_b PLL_DR_CLK_MULT_PARAM 0
set_instance_parameter_value qdr_b PLL_DR_CLK_PHASE_PS_PARAM 0
set_instance_parameter_value qdr_b PLL_HR_CLK_DIV_PARAM 0
set_instance_parameter_value qdr_b PLL_HR_CLK_FREQ_PARAM 0.0
set_instance_parameter_value qdr_b PLL_HR_CLK_MULT_PARAM 0
set_instance_parameter_value qdr_b PLL_HR_CLK_PHASE_PS_PARAM 0
set_instance_parameter_value qdr_b PLL_LOCATION Top_Bottom
set_instance_parameter_value qdr_b PLL_MEM_CLK_DIV_PARAM 0
set_instance_parameter_value qdr_b PLL_MEM_CLK_FREQ_PARAM 0.0
set_instance_parameter_value qdr_b PLL_MEM_CLK_MULT_PARAM 0
set_instance_parameter_value qdr_b PLL_MEM_CLK_PHASE_PS_PARAM 0
set_instance_parameter_value qdr_b PLL_NIOS_CLK_DIV_PARAM 0
set_instance_parameter_value qdr_b PLL_NIOS_CLK_FREQ_PARAM 0.0
set_instance_parameter_value qdr_b PLL_NIOS_CLK_MULT_PARAM 0
set_instance_parameter_value qdr_b PLL_NIOS_CLK_PHASE_PS_PARAM 0
set_instance_parameter_value qdr_b PLL_P2C_READ_CLK_DIV_PARAM 0
set_instance_parameter_value qdr_b PLL_P2C_READ_CLK_FREQ_PARAM 0.0
set_instance_parameter_value qdr_b PLL_P2C_READ_CLK_MULT_PARAM 0
set_instance_parameter_value qdr_b PLL_P2C_READ_CLK_PHASE_PS_PARAM 0
set_instance_parameter_value qdr_b PLL_SHARING_MODE Master
set_instance_parameter_value qdr_b PLL_WRITE_CLK_DIV_PARAM 0
set_instance_parameter_value qdr_b PLL_WRITE_CLK_FREQ_PARAM 0.0
set_instance_parameter_value qdr_b PLL_WRITE_CLK_MULT_PARAM 0
set_instance_parameter_value qdr_b PLL_WRITE_CLK_PHASE_PS_PARAM 0
set_instance_parameter_value qdr_b POWER_OF_TWO_BUS true
set_instance_parameter_value qdr_b QDRII_PLUS_MODE false
set_instance_parameter_value qdr_b RATE Half
set_instance_parameter_value qdr_b READ_DQ_DQS_CLOCK_SOURCE DQS_BUS
set_instance_parameter_value qdr_b READ_FIFO_SIZE 8
set_instance_parameter_value qdr_b REFRESH_INTERVAL 15000
set_instance_parameter_value qdr_b REF_CLK_FREQ 50.0
set_instance_parameter_value qdr_b REF_CLK_FREQ_MAX_PARAM 0.0
set_instance_parameter_value qdr_b REF_CLK_FREQ_MIN_PARAM 0.0
set_instance_parameter_value qdr_b REF_CLK_FREQ_PARAM_VALID false
set_instance_parameter_value qdr_b SEQUENCER_TYPE NIOS
set_instance_parameter_value qdr_b SKIP_MEM_INIT true
set_instance_parameter_value qdr_b SOPC_COMPAT_RESET false
set_instance_parameter_value qdr_b SPEED_GRADE 2
set_instance_parameter_value qdr_b TIMING_ADDR_CTRL_SKEW 30
set_instance_parameter_value qdr_b TIMING_BOARD_AC_EYE_REDUCTION_H 0
set_instance_parameter_value qdr_b TIMING_BOARD_AC_EYE_REDUCTION_SU 0
set_instance_parameter_value qdr_b TIMING_BOARD_AC_TO_CK_SKEW 6
set_instance_parameter_value qdr_b TIMING_BOARD_DATA_TO_CQ_SKEW 6
set_instance_parameter_value qdr_b TIMING_BOARD_DATA_TO_K_SKEW 8
set_instance_parameter_value qdr_b TIMING_BOARD_DELTA_DQS_ARRIVAL_TIME 0
set_instance_parameter_value qdr_b TIMING_BOARD_DELTA_READ_DQS_ARRIVAL_TIME 0.0
set_instance_parameter_value qdr_b TIMING_BOARD_DQ_EYE_REDUCTION 0
set_instance_parameter_value qdr_b TIMING_BOARD_READ_DQ_EYE_REDUCTION 0.0
set_instance_parameter_value qdr_b TIMING_BOARD_SKEW 20
set_instance_parameter_value qdr_b TIMING_BOARD_SKEW_BETWEEN_DIMMS 0
set_instance_parameter_value qdr_b TIMING_BOARD_SKEW_BETWEEN_DQS 14
set_instance_parameter_value qdr_b TIMING_BOARD_SKEW_WITHIN_CQ 14
set_instance_parameter_value qdr_b TIMING_BOARD_SKEW_WITHIN_K 16
set_instance_parameter_value qdr_b TIMING_QDR_INTERNAL_JITTER 150
set_instance_parameter_value qdr_b TIMING_TCQD 200
set_instance_parameter_value qdr_b TIMING_TCQDOH -200
set_instance_parameter_value qdr_b TIMING_TCQHCQnH 895
set_instance_parameter_value qdr_b TIMING_THA 300
set_instance_parameter_value qdr_b TIMING_THD 250
set_instance_parameter_value qdr_b TIMING_TKH 400
set_instance_parameter_value qdr_b TIMING_TKHKnH 990
set_instance_parameter_value qdr_b TIMING_TSA 300
set_instance_parameter_value qdr_b TIMING_TSD 250
set_instance_parameter_value qdr_b TRACKING_ERROR_TEST false
set_instance_parameter_value qdr_b TRACKING_WATCH_TEST false
set_instance_parameter_value qdr_b TREFI 35100
set_instance_parameter_value qdr_b TRFC 350
set_instance_parameter_value qdr_b USER_DEBUG_LEVEL 0
set_instance_parameter_value qdr_b USE_FAKE_PHY false
set_instance_parameter_value qdr_b USE_MEM_CLK_FREQ false
set_instance_parameter_value qdr_b USE_SEQUENCER_BFM false

add_instance qdr_b_r_bridge altera_avalon_mm_clock_crossing_bridge 16.1
set_instance_property qdr_b_r_bridge ENABLED false
set_instance_parameter_value qdr_b_r_bridge ADDRESS_UNITS WORDS
set_instance_parameter_value qdr_b_r_bridge ADDRESS_WIDTH 20
set_instance_parameter_value qdr_b_r_bridge COMMAND_FIFO_DEPTH 16
set_instance_parameter_value qdr_b_r_bridge DATA_WIDTH 64
set_instance_parameter_value qdr_b_r_bridge MASTER_SYNC_DEPTH 2
set_instance_parameter_value qdr_b_r_bridge MAX_BURST_SIZE 4
set_instance_parameter_value qdr_b_r_bridge RESPONSE_FIFO_DEPTH 32
set_instance_parameter_value qdr_b_r_bridge SLAVE_SYNC_DEPTH 2
set_instance_parameter_value qdr_b_r_bridge USE_AUTO_ADDRESS_WIDTH 0

add_instance qdr_b_w_bridge altera_avalon_mm_clock_crossing_bridge 16.1
set_instance_property qdr_b_w_bridge ENABLED false
set_instance_parameter_value qdr_b_w_bridge ADDRESS_UNITS WORDS
set_instance_parameter_value qdr_b_w_bridge ADDRESS_WIDTH 20
set_instance_parameter_value qdr_b_w_bridge COMMAND_FIFO_DEPTH 16
set_instance_parameter_value qdr_b_w_bridge DATA_WIDTH 64
set_instance_parameter_value qdr_b_w_bridge MASTER_SYNC_DEPTH 2
set_instance_parameter_value qdr_b_w_bridge MAX_BURST_SIZE 4
set_instance_parameter_value qdr_b_w_bridge RESPONSE_FIFO_DEPTH 32
set_instance_parameter_value qdr_b_w_bridge SLAVE_SYNC_DEPTH 2
set_instance_parameter_value qdr_b_w_bridge USE_AUTO_ADDRESS_WIDTH 0

add_instance qdr_c altera_mem_if_qdrii_emif 16.1
set_instance_property qdr_c ENABLED false
set_instance_parameter_value qdr_c ABSTRACT_REAL_COMPARE_TEST false
set_instance_parameter_value qdr_c ACV_PHY_CLK_ADD_FR_PHASE 0.0
set_instance_parameter_value qdr_c AC_PACKAGE_DESKEW true
set_instance_parameter_value qdr_c AC_ROM_USER_ADD_0 0_0000_0000_0000
set_instance_parameter_value qdr_c AC_ROM_USER_ADD_1 0_0000_0000_1000
set_instance_parameter_value qdr_c ADD_EFFICIENCY_MONITOR false
set_instance_parameter_value qdr_c ADD_EXTERNAL_SEQ_DEBUG_NIOS false
set_instance_parameter_value qdr_c ADVERTIZE_SEQUENCER_SW_BUILD_FILES false
set_instance_parameter_value qdr_c AFI_DEBUG_INFO_WIDTH 32
set_instance_parameter_value qdr_c AVL_MAX_SIZE 4
set_instance_parameter_value qdr_c BYTE_ENABLE false
set_instance_parameter_value qdr_c C2P_WRITE_CLOCK_ADD_PHASE 0.0
set_instance_parameter_value qdr_c CALIBRATION_MODE Full
set_instance_parameter_value qdr_c CALIB_REG_WIDTH 8
set_instance_parameter_value qdr_c COMMAND_PHASE 0
set_instance_parameter_value qdr_c CORE_DEBUG_CONNECTION EXPORT
set_instance_parameter_value qdr_c CTL_LATENCY 1
set_instance_parameter_value qdr_c CUT_NEW_FAMILY_TIMING true
set_instance_parameter_value qdr_c DEVICE_DEPTH 1
set_instance_parameter_value qdr_c DEVICE_WIDTH 1
set_instance_parameter_value qdr_c DISABLE_CHILD_MESSAGING false
set_instance_parameter_value qdr_c DLL_SHARING_MODE Slave
set_instance_parameter_value qdr_c DQS_DQSN_MODE COMPLEMENTARY
set_instance_parameter_value qdr_c DQ_INPUT_REG_USE_CLKN true
set_instance_parameter_value qdr_c DUPLICATE_AC false
set_instance_parameter_value qdr_c ED_EXPORT_SEQ_DEBUG false
set_instance_parameter_value qdr_c EMULATED_MODE false
set_instance_parameter_value qdr_c EMULATED_WRITE_GROUPS 2
set_instance_parameter_value qdr_c ENABLE_CTRL_AVALON_INTERFACE true
set_instance_parameter_value qdr_c ENABLE_DELAY_CHAIN_WRITE false
set_instance_parameter_value qdr_c ENABLE_EMIT_BFM_MASTER false
set_instance_parameter_value qdr_c ENABLE_EXPORT_SEQ_DEBUG_BRIDGE false
set_instance_parameter_value qdr_c ENABLE_EXTRA_REPORTING false
set_instance_parameter_value qdr_c ENABLE_ISS_PROBES false
set_instance_parameter_value qdr_c ENABLE_NON_DESTRUCTIVE_CALIB false
set_instance_parameter_value qdr_c ENABLE_NON_DES_CAL false
set_instance_parameter_value qdr_c ENABLE_NON_DES_CAL_TEST false
set_instance_parameter_value qdr_c ENABLE_SEQUENCER_MARGINING_ON_BY_DEFAULT false
set_instance_parameter_value qdr_c EXPORT_AFI_HALF_CLK false
set_instance_parameter_value qdr_c FIX_READ_LATENCY 8
set_instance_parameter_value qdr_c FORCE_DQS_TRACKING AUTO
set_instance_parameter_value qdr_c FORCE_MAX_LATENCY_COUNT_WIDTH 0
set_instance_parameter_value qdr_c FORCE_SEQUENCER_TCL_DEBUG_MODE false
set_instance_parameter_value qdr_c FORCE_SHADOW_REGS AUTO
set_instance_parameter_value qdr_c HARD_EMIF false
set_instance_parameter_value qdr_c HCX_COMPAT_MODE false
set_instance_parameter_value qdr_c HHP_HPS false
set_instance_parameter_value qdr_c HHP_HPS_SIMULATION false
set_instance_parameter_value qdr_c HHP_HPS_VERIFICATION false
set_instance_parameter_value qdr_c HPS_PROTOCOL DEFAULT
set_instance_parameter_value qdr_c INCLUDE_BOARD_DELAY_MODEL false
set_instance_parameter_value qdr_c INCLUDE_MULTIRANK_BOARD_DELAY_MODEL false
set_instance_parameter_value qdr_c IO_STANDARD {1.8-V HSTL}
set_instance_parameter_value qdr_c IS_ES_DEVICE false
set_instance_parameter_value qdr_c MARGIN_VARIATION_TEST false
set_instance_parameter_value qdr_c MAX10_RTL_SEQ false
set_instance_parameter_value qdr_c MEM_ADDR_WIDTH 20
set_instance_parameter_value qdr_c MEM_BURST_LENGTH 4
set_instance_parameter_value qdr_c MEM_CK_PHASE 0.0
set_instance_parameter_value qdr_c MEM_CLK_FREQ 450.0
set_instance_parameter_value qdr_c MEM_CONTROL_WIDTH 1
set_instance_parameter_value qdr_c MEM_CS_WIDTH 1
set_instance_parameter_value qdr_c MEM_DENALI_SOMA_FILE qdrii.soma
set_instance_parameter_value qdr_c MEM_DEVICE MISSING_MODEL
set_instance_parameter_value qdr_c MEM_DM_WIDTH 2
set_instance_parameter_value qdr_c MEM_DQ_WIDTH 18
set_instance_parameter_value qdr_c MEM_IF_BOARD_BASE_DELAY 10
set_instance_parameter_value qdr_c MEM_IF_DM_PINS_EN true
set_instance_parameter_value qdr_c MEM_IF_DQSN_EN true
set_instance_parameter_value qdr_c MEM_LEVELING false
set_instance_parameter_value qdr_c MEM_READ_DQS_WIDTH 1
set_instance_parameter_value qdr_c MEM_SUPPRESS_CMD_TIMING_ERROR 0
set_instance_parameter_value qdr_c MEM_T_RL 2.5
set_instance_parameter_value qdr_c MEM_T_WL 1
set_instance_parameter_value qdr_c MEM_USE_DENALI_MODEL false
set_instance_parameter_value qdr_c MEM_VERBOSE true
set_instance_parameter_value qdr_c MEM_WRITE_DQS_WIDTH 1
set_instance_parameter_value qdr_c MRS_MIRROR_PING_PONG_ATSO false
set_instance_parameter_value qdr_c NIOS_ROM_DATA_WIDTH 32
set_instance_parameter_value qdr_c NUM_DLL_SHARING_INTERFACES 1
set_instance_parameter_value qdr_c NUM_EXTRA_REPORT_PATH 10
set_instance_parameter_value qdr_c NUM_OCT_SHARING_INTERFACES 1
set_instance_parameter_value qdr_c NUM_PLL_SHARING_INTERFACES 1
set_instance_parameter_value qdr_c OCT_SHARING_MODE Slave
set_instance_parameter_value qdr_c P2C_READ_CLOCK_ADD_PHASE 0.0
set_instance_parameter_value qdr_c PACKAGE_DESKEW true
set_instance_parameter_value qdr_c PARSE_FRIENDLY_DEVICE_FAMILY_PARAM_VALID false
set_instance_parameter_value qdr_c PHY_CSR_ENABLED false
set_instance_parameter_value qdr_c PHY_ONLY false
set_instance_parameter_value qdr_c PINGPONGPHY_EN false
set_instance_parameter_value qdr_c PLL_ADDR_CMD_CLK_DIV_PARAM 0
set_instance_parameter_value qdr_c PLL_ADDR_CMD_CLK_FREQ_PARAM 0.0
set_instance_parameter_value qdr_c PLL_ADDR_CMD_CLK_MULT_PARAM 0
set_instance_parameter_value qdr_c PLL_ADDR_CMD_CLK_PHASE_PS_PARAM 0
set_instance_parameter_value qdr_c PLL_AFI_CLK_DIV_PARAM 0
set_instance_parameter_value qdr_c PLL_AFI_CLK_FREQ_PARAM 0.0
set_instance_parameter_value qdr_c PLL_AFI_CLK_MULT_PARAM 0
set_instance_parameter_value qdr_c PLL_AFI_CLK_PHASE_PS_PARAM 0
set_instance_parameter_value qdr_c PLL_AFI_HALF_CLK_DIV_PARAM 0
set_instance_parameter_value qdr_c PLL_AFI_HALF_CLK_FREQ_PARAM 0.0
set_instance_parameter_value qdr_c PLL_AFI_HALF_CLK_MULT_PARAM 0
set_instance_parameter_value qdr_c PLL_AFI_HALF_CLK_PHASE_PS_PARAM 0
set_instance_parameter_value qdr_c PLL_AFI_PHY_CLK_DIV_PARAM 0
set_instance_parameter_value qdr_c PLL_AFI_PHY_CLK_FREQ_PARAM 0.0
set_instance_parameter_value qdr_c PLL_AFI_PHY_CLK_MULT_PARAM 0
set_instance_parameter_value qdr_c PLL_AFI_PHY_CLK_PHASE_PS_PARAM 0
set_instance_parameter_value qdr_c PLL_C2P_WRITE_CLK_DIV_PARAM 0
set_instance_parameter_value qdr_c PLL_C2P_WRITE_CLK_FREQ_PARAM 0.0
set_instance_parameter_value qdr_c PLL_C2P_WRITE_CLK_MULT_PARAM 0
set_instance_parameter_value qdr_c PLL_C2P_WRITE_CLK_PHASE_PS_PARAM 0
set_instance_parameter_value qdr_c PLL_CLK_PARAM_VALID false
set_instance_parameter_value qdr_c PLL_CONFIG_CLK_DIV_PARAM 0
set_instance_parameter_value qdr_c PLL_CONFIG_CLK_FREQ_PARAM 0.0
set_instance_parameter_value qdr_c PLL_CONFIG_CLK_MULT_PARAM 0
set_instance_parameter_value qdr_c PLL_CONFIG_CLK_PHASE_PS_PARAM 0
set_instance_parameter_value qdr_c PLL_DR_CLK_DIV_PARAM 0
set_instance_parameter_value qdr_c PLL_DR_CLK_FREQ_PARAM 0.0
set_instance_parameter_value qdr_c PLL_DR_CLK_MULT_PARAM 0
set_instance_parameter_value qdr_c PLL_DR_CLK_PHASE_PS_PARAM 0
set_instance_parameter_value qdr_c PLL_HR_CLK_DIV_PARAM 0
set_instance_parameter_value qdr_c PLL_HR_CLK_FREQ_PARAM 0.0
set_instance_parameter_value qdr_c PLL_HR_CLK_MULT_PARAM 0
set_instance_parameter_value qdr_c PLL_HR_CLK_PHASE_PS_PARAM 0
set_instance_parameter_value qdr_c PLL_LOCATION Top_Bottom
set_instance_parameter_value qdr_c PLL_MEM_CLK_DIV_PARAM 0
set_instance_parameter_value qdr_c PLL_MEM_CLK_FREQ_PARAM 0.0
set_instance_parameter_value qdr_c PLL_MEM_CLK_MULT_PARAM 0
set_instance_parameter_value qdr_c PLL_MEM_CLK_PHASE_PS_PARAM 0
set_instance_parameter_value qdr_c PLL_NIOS_CLK_DIV_PARAM 0
set_instance_parameter_value qdr_c PLL_NIOS_CLK_FREQ_PARAM 0.0
set_instance_parameter_value qdr_c PLL_NIOS_CLK_MULT_PARAM 0
set_instance_parameter_value qdr_c PLL_NIOS_CLK_PHASE_PS_PARAM 0
set_instance_parameter_value qdr_c PLL_P2C_READ_CLK_DIV_PARAM 0
